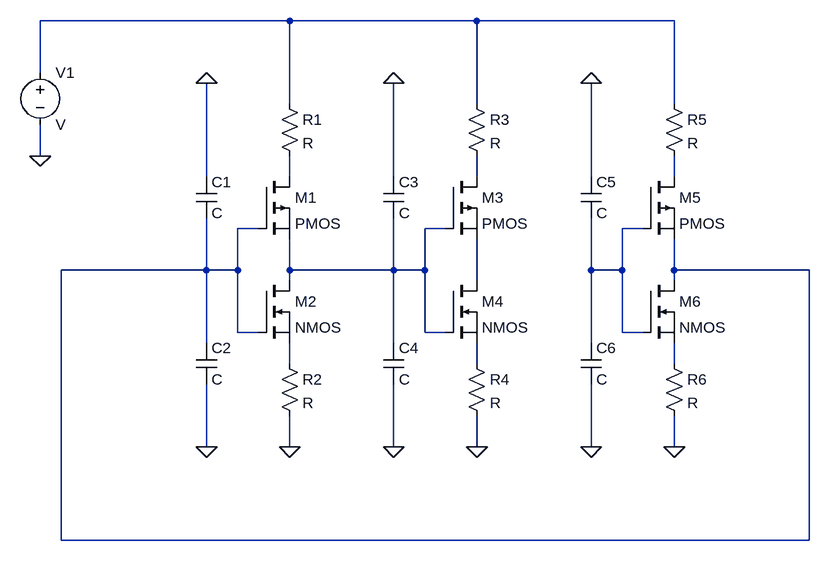
[diagram p0: schematic Draft1.asc]
Draft1.asc, the LTspice schematic file:
Version 4
SHEET 1 948 680
WIRE 144 -208 -240 -208
WIRE 432 -208 144 -208
WIRE 736 -208 432 -208
WIRE -240 -128 -240 -208
WIRE 144 -80 144 -208
WIRE 432 -80 432 -208
WIRE 736 -80 736 -208
WIRE -240 0 -240 -48
WIRE 16 32 16 -112
WIRE 144 32 144 0
WIRE 304 32 304 -112
WIRE 432 32 432 0
WIRE 608 32 608 -112
WIRE 736 32 736 0
WIRE 96 112 64 112
WIRE 384 112 352 112
WIRE 688 112 656 112
WIRE 16 176 16 96
WIRE 16 176 -208 176
WIRE 64 176 64 112
WIRE 64 176 16 176
WIRE 144 176 144 128
WIRE 304 176 304 96
WIRE 304 176 144 176
WIRE 352 176 352 112
WIRE 352 176 304 176
WIRE 608 176 608 96
WIRE 656 176 656 112
WIRE 656 176 608 176
WIRE 736 176 736 128
WIRE 944 176 736 176
WIRE 144 192 144 176
WIRE 432 192 432 128
WIRE 736 192 736 176
WIRE 64 272 64 176
WIRE 96 272 64 272
WIRE 352 272 352 176
WIRE 384 272 352 272
WIRE 656 272 656 176
WIRE 688 272 656 272
WIRE 16 288 16 176
WIRE 304 288 304 176
WIRE 608 288 608 176
WIRE 144 320 144 288
WIRE 432 320 432 288
WIRE 736 320 736 288
WIRE 16 448 16 352
WIRE 144 448 144 400
WIRE 304 448 304 352
WIRE 432 448 432 400
WIRE 608 448 608 352
WIRE 736 448 736 400
WIRE -208 592 -208 176
WIRE 944 592 944 176
WIRE 944 592 -208 592
FLAG 16 -112 0
FLAG 16 448 0
FLAG 144 448 0
FLAG 304 -112 0
FLAG 304 448 0
FLAG 432 448 0
FLAG 608 -112 0
FLAG 608 448 0
FLAG 736 448 0
FLAG -240 0 0
SYMBOL pmos 96 32 R0
SYMATTR InstName M1
SYMBOL nmos 96 192 R0
SYMATTR InstName M2
SYMBOL res 128 -96 R0
SYMATTR InstName R1
SYMBOL res 128 304 R0
SYMATTR InstName R2
SYMBOL cap 0 32 R0
SYMATTR InstName C1
SYMATTR SpiceLine IC=0
SYMBOL cap 0 288 R0
SYMATTR InstName C2
SYMBOL pmos 384 32 R0
SYMATTR InstName M3
SYMBOL nmos 384 192 R0
SYMATTR InstName M4
SYMBOL res 416 -96 R0
SYMATTR InstName R3
SYMBOL res 416 304 R0
SYMATTR InstName R4
SYMBOL cap 288 32 R0
SYMATTR InstName C3
SYMBOL cap 288 288 R0
SYMATTR InstName C4
SYMBOL pmos 688 32 R0
SYMATTR InstName M5
SYMBOL nmos 688 192 R0
SYMATTR InstName M6
SYMBOL res 720 -96 R0
SYMATTR InstName R5
SYMBOL res 720 304 R0
SYMATTR InstName R6
SYMBOL cap 592 32 R0
SYMATTR InstName C5
SYMBOL cap 592 288 R0
SYMATTR InstName C6
SYMBOL voltage -240 -144 R0
SYMATTR InstName V1

The netlist it stands for:
* Draft1.asc
M1 N002 N005 N006 N006 PMOS
M2 N006 N005 N009 N009 NMOS
R1 N001 N002 R
R2 N009 0 R
C1 0 N005 C IC=0
C2 N005 0 C
M3 N003 N006 N008 N008 PMOS
M4 N008 N006 N010 N010 NMOS
R3 N001 N003 R
R4 N010 0 R
C3 0 N006 C
C4 N006 0 C
M5 N004 N007 N005 N005 PMOS
M6 N005 N007 N011 N011 NMOS
R5 N001 N004 R
R6 N011 0 R
C5 0 N007 C
C6 N007 0 C
V1 N001 0 V
.model NMOS NMOS
.model PMOS PMOS
.lib standard.mos
.backanno
.end